# Altium schematic sheet GearDisplay.SchDoc
size A4; Author: Wojciech Gredel; CompanyName: AGH UST; Revision: 1; ProjectName: My_project1
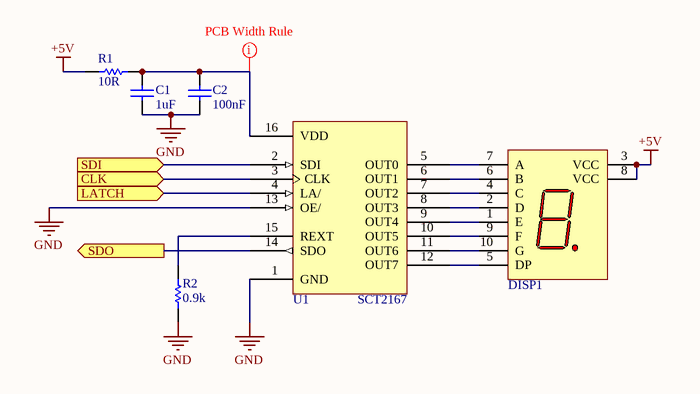
[diagram p0: GearDisplay.SchDoc]

## Parts
C1  value 1uF  [CAP_0805_IPC_MD]  (hidden comment: Cap)
C2  value 100nF  [CAP_0805_IPC_MD]  (hidden comment: Cap)
DISP1  7SEG DISP  [7_SEG_LED_0.8_INCH]  (value not drawn)
R1  value 10R  [RES_0805_IPC_MD]  (hidden comment: Res)
R2  value 0.9k  [RES_0805_IPC_MD]  (hidden comment: Res)
U1  SCT2167  [SSOP_16_IPC_MD]

## Ports
CLK (in), LATCH (in), SDI (in), SDO (out)

## Nets
+5V: DISP1.3(VCC) DISP1.8(VCC) R1.1
GND: C1.1 C2.1 R2.2 U1.1(GND) U1.13(OE/)
CLK: U1.3(CLK) ; port CLK
LATCH: U1.4(LA/) ; port LATCH
SDI: U1.2(SDI) ; port SDI
SDO: U1.14(SDO) ; port SDO
NetC1_2: C1.2 C2.2 R1.2 U1.16(VDD)
NetDISP1_1: DISP1.1(E) U1.9(OUT4)
NetDISP1_2: DISP1.2(D) U1.8(OUT3)
NetDISP1_4: DISP1.4(C) U1.7(OUT2)
NetDISP1_5: DISP1.5(DP) U1.12(OUT7)
NetDISP1_6: DISP1.6(B) U1.6(OUT1)
NetDISP1_7: DISP1.7(A) U1.5(OUT0)
NetDISP1_9: DISP1.9(F) U1.10(OUT5)
NetDISP1_10: DISP1.10(G) U1.11(OUT6)
NetR2_1: R2.1 U1.15(REXT)

## Layout directives
rule Width Constraint [Pref Width = 25mil    Min Width = 20mil    Max Width = 30mil]: NetC1_2

## Notes on the sheet
- Confidential / Not for distribution !
- Project name:
- Document name:
- Designer Name:
- Date/Time:
- Revision:

## Library data of the parts
C1 C2 = Cap: Capacitor; Manufacturer: Samsung; Supplier: TME
  C1: Supplier Part Number: CL21B105KOFNNNF
  C2: Supplier Part Number: CL21B104KBCNNNC
DISP1 = 7SEG DISP: OPTO PLUS LED CORP. OPD-S8023LB-BW; Supplier: TME; Supplier Part Number: OPD-S8023LB-BW; Manufacturer: Opto Plus Led Corp.
R1 R2 = Res: Resistor; Manufacturer: Royal Ohm; Supplier: TME
  R1: Supplier Part Number: HP05-10R5%
  R2: Supplier Part Number: SMD0805-910R-1%
U1 = SCT2167: Led controller; Manufacturer: Starchips Technology; Supplier: TME; Supplier Part Number: SCT2167CSSG